# Altium project Lite Carrier for Mu.PrjPcb (part 2 of 2)

## Sheet USB2.0&USB3.0.SchDoc
size 594 x 420 mm
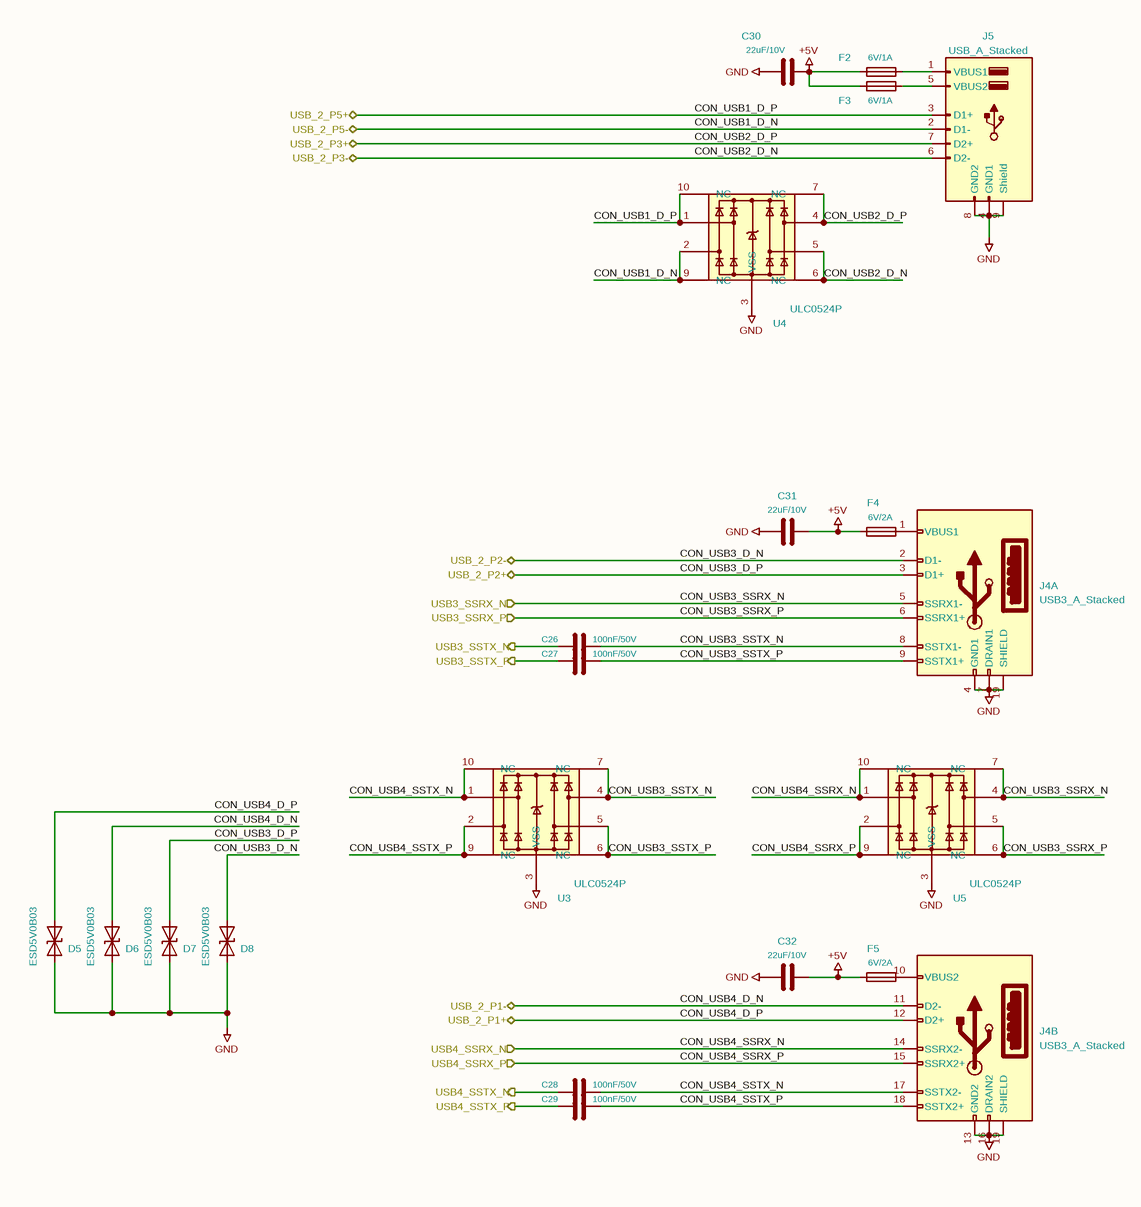
[diagram p17: USB2.0&USB3.0.SchDoc]

### Parts
C26  100nF/50V  [C_0402_1005Metric]
C27  100nF/50V  [C_0402_1005Metric]
C28  100nF/50V  [C_0402_1005Metric]
C29  100nF/50V  [C_0402_1005Metric]
C30  22uF/10V  [C_0603_1608Metric]
C31  22uF/10V  [C_0603_1608Metric]
C32  22uF/10V  [C_0603_1608Metric]
D5  ESD5V0B03  [D_0402_1005Metric]
D6  ESD5V0B03  [D_0402_1005Metric]
D7  ESD5V0B03  [D_0402_1005Metric]
D8  ESD5V0B03  [D_0402_1005Metric]
F2  6V/1A  [Fuse_0805_2012Metric]
F3  6V/1A  [Fuse_0805_2012Metric]
F4  6V/2A  [R_0805_2012Metric]
F5  6V/2A  [Fuse_0805_2012Metric]
J4  USB3_A_Stacked  [USB3_A_Molex_48406-0001_Horizontal_Stacked]  (parts A,B of 2)
J5  USB_A_Stacked  [USB_A_CUI_UJ2-ADH-TH_Horizontal_Stacked]
U3  ULC0524P  [Diodes_UDFN-10_1.0x2.5mm_P0.5mm]
U4  ULC0524P  [Diodes_UDFN-10_1.0x2.5mm_P0.5mm]
U5  ULC0524P  [Diodes_UDFN-10_1.0x2.5mm_P0.5mm]

### Ports
USB3_SSRX_N (in), USB3_SSRX_P (in), USB3_SSTX_N (out), USB3_SSTX_P (out), USB4_SSRX_N (in), USB4_SSRX_P (in), USB4_SSTX_N (out), USB4_SSTX_P (out), USB_2_P1+ (bidir), USB_2_P1- (bidir), USB_2_P2+ (bidir), USB_2_P2- (bidir), USB_2_P3+ (bidir), USB_2_P3- (bidir), USB_2_P5+ (bidir), USB_2_P5- (bidir)

### Nets
+5V: C30.2 C31.2 C32.2 F2.1 F3.1 F4.1 F5.1
GND: C30.1 C31.1 C32.1 D5.1(A1) D6.1(A1) D7.1(A1) D8.1(A1) J4.4(GND1) J4.7(DRAIN1) J4.13(GND2) J4.16(DRAIN2) J4.19(SHIELD) J5.4(GND1) J5.8(GND2) J5.9(Shield) U3.3(VSS) U4.3(VSS) U5.3(VSS)
CON_USB1_D_N: J5.2(D1-) U4.2 U4.9(NC) ; port USB_2_P5-
CON_USB1_D_P: J5.3(D1+) U4.1 U4.10(NC) ; port USB_2_P5+
CON_USB2_D_N: J5.6(D2-) U4.5 U4.6(NC) ; port USB_2_P3-
CON_USB2_D_P: J5.7(D2+) U4.4 U4.7(NC) ; port USB_2_P3+
CON_USB3_D_N: D8.2(A2) J4.2(D1-) ; port USB_2_P2-
CON_USB3_D_P: D7.2(A2) J4.3(D1+) ; port USB_2_P2+
CON_USB3_SSRX_N: J4.5(SSRX1-) U5.4 U5.7(NC) ; port USB3_SSRX_N
CON_USB3_SSRX_P: J4.6(SSRX1+) U5.5 U5.6(NC) ; port USB3_SSRX_P
CON_USB3_SSTX_N: C26.2 J4.8(SSTX1-) U3.4 U3.7(NC)
CON_USB3_SSTX_P: C27.2 J4.9(SSTX1+) U3.5 U3.6(NC)
CON_USB4_D_N: D6.2(A2) J4.11(D2-) ; port USB_2_P1-
CON_USB4_D_P: D5.2(A2) J4.12(D2+) ; port USB_2_P1+
CON_USB4_SSRX_N: J4.14(SSRX2-) U5.1 U5.10(NC) ; port USB4_SSRX_N
CON_USB4_SSRX_P: J4.15(SSRX2+) U5.2 U5.9(NC) ; port USB4_SSRX_P
CON_USB4_SSTX_N: C28.2 J4.17(SSTX2-) U3.1 U3.10(NC)
CON_USB4_SSTX_P: C29.2 J4.18(SSTX2+) U3.2 U3.9(NC)
USB3_SSTX_N: C26.1 ; port USB3_SSTX_N
USB3_SSTX_P: C27.1 ; port USB3_SSTX_P
USB4_SSTX_N: C28.1 ; port USB4_SSTX_N
USB4_SSTX_P: C29.1 ; port USB4_SSTX_P
NetF2_2: F2.2 J5.1(VBUS1)
NetF3_2: F3.2 J5.5(VBUS2)
NetF4_2: F4.2 J4.1(VBUS1)
NetF5_2: F5.2 J4.10(VBUS2)

Not connected (* = marked no-connect by the designer): U3 8(VSS); U4 8(VSS); U5 8(VSS)

### Notes on the sheet
- 1
- 2
- 3
- 4
- 5
- 6
- 7
- 8
- 9
- 10
- 11
- A
- B
- C
- D
- E
- F
- G
- H
- Title: Primer Carrier for LattePanda Mu
- File: USB2.0&USB3.0.kicad_sch
- Sheet: /
- DFRobot
- KiCad E.D.A.  kicad (5.1.4)-1
- Size: A2
- Date: 2024-03-13
- Rev: V1.0.0
- Id: 1/1

### Library data of the parts
C26-C29 = C: SCH_Show_Footprint: C0402; Value: 100nF/50V; Footprint: A_HDJ_Library:C_0402_1005Metric
C30-C32 = C: SCH_Show_Footprint: C603; Value: 22uF/10V; Footprint: A_HDJ_Library:C_0603_1608Metric
D5-D8 = ESD9B5.0ST5G: SCH_Show_Footprint: D0402; Value: ESD5V0B03; Footprint: A_HDJ_Library:D_0402_1005Metric
F2 F3 = Fuse: SCH_Show_Footprint: R0603; Value: 6V/1A; Footprint: A_HDJ_Library:Fuse_0805_2012Metric
F4 F5 = Fuse: SCH_Show_Footprint: R0805; Value: 6V/2A
  F4: Footprint: A_HDJ_Library:R_0805_2012Metric
  F5: Footprint: A_HDJ_Library:Fuse_0805_2012Metric
U3-U5 = D3V3XA4B10LP: Value: ULC0524P; Footprint: A_HDJ_Library:Diodes_UDFN-10_1.0x2.5mm_P0.5mm
J4 = USB3_A_Stacked: Value: USB3_A_Stacked; Footprint: A_HDJ_Library:USB3_A_Molex_48406-0001_Horizontal_Stacked
J5 = USB_A_Stacked: Value: USB_A_Stacked; Footprint: A_HDJ_Library:USB_A_CUI_UJ2-ADH-TH_Horizontal_Stacked

## Sheet fan&temp.SchDoc
size 594 x 420 mm
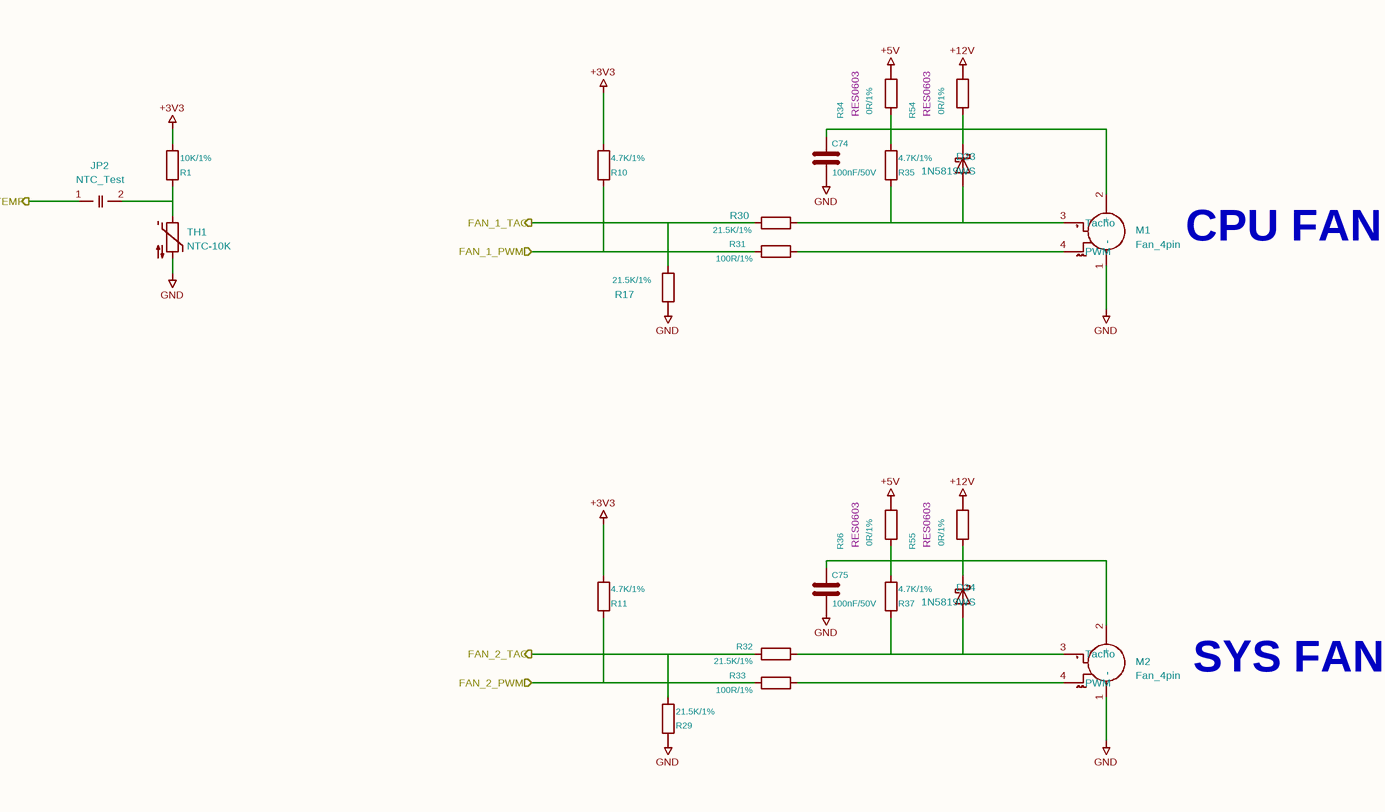
[diagram p18: fan&temp.SchDoc]

### Parts
(Parts that share a designator on the sheet are numbered #1, #2 ... from top to bottom, then left to right.)
C74#2  100nF/50V  [C_0402_1005Metric]
C75#2  100nF/50V  [C_0402_1005Metric]
D23#2  1N5819WS  [D_SOD-323]
D24#2  1N5819WS  [D_SOD-323]
JP2#2  NTC_Test  [SolderJumper-2_P1.3mm_Open_RoundedPad1.0x1.5mm]
M1#2  Fan_4pin  [JST_PH_B4B-PH-K_1x04_P2.00mm_Vertical]
M2#2  Fan_4pin  [JST_PH_B4B-PH-K_1x04_P2.00mm_Vertical]
R1#2  10K/1%  [R_0402_1005Metric]
R10#2  4.7K/1%  [R_0402_1005Metric]
R11#2  4.7K/1%  [R_0402_1005Metric]
R17#2  21.5K/1%  [R_0402_1005Metric]
R29#2  21.5K/1%  [R_0402_1005Metric]
R30#2  21.5K/1%  [R_0402_1005Metric]
R31  100R/1%  [R_0402_1005Metric]
R32#2  21.5K/1%  [R_0402_1005Metric]
R33#2  100R/1%  [R_0402_1005Metric]
R34#2  0R/1%  [RES0603]
R35#2  4.7K/1%  [R_0402_1005Metric]
R36#2  0R/1%  [RES0603]
R37#2  4.7K/1%  [R_0402_1005Metric]
R54#2  0R/1%  [RES0603]
R55#2  0R/1%  [RES0603]
TH1#2  NTC-10K  [R_0603_1608Metric]

### Ports
FAN_1_PWM (in), FAN_1_TAC (out), FAN_2_PWM (in), FAN_2_TAC (out), TEMP (out)

### Nets
+3V3: R1#2.1 R10#2.1 R11#2.1
+5V: R34#2.2 R36#2.2
+12V: R54#2.2 R55#2.2
GND: C74#2.2 C75#2.2 M1#2.1(-) M2#2.1(-) R17#2.2 R29#2.2 TH1#2.2
FAN_1_PWM: R10#2.2 R31.1 ; port FAN_1_PWM
FAN_1_TAC: R17#2.1 R30#2.2 ; port FAN_1_TAC
FAN_2_PWM: R11#2.2 R33#2.1 ; port FAN_2_PWM
FAN_2_TAC: R29#2.1 R32#2.1 ; port FAN_2_TAC
TEMP: JP2#2.1(A) ; port TEMP
NetC74#2_1: C74#2.1 D23#2.1(K) M1#2.2(+) R34#2.1 R35#2.1 R54#2.1
NetC75#2_1: C75#2.1 D24#2.1(K) M2#2.2(+) R36#2.1 R37#2.1 R55#2.1
NetD23#2_2: D23#2.2(A) M1#2.3(Tacho) R30#2.1 R35#2.2
NetD24#2_2: D24#2.2(A) M2#2.3(Tacho) R32#2.2 R37#2.2
NetJP2#2_2: JP2#2.2(B) R1#2.2 TH1#2.1
NetM1#2_4: M1#2.4(PWM) R31.2
NetM2#2_4: M2#2.4(PWM) R33#2.2

### Notes on the sheet
- CPU FAN
- SYS FAN
- 1
- 2
- 3
- 4
- 5
- 6
- 7
- 8
- 9
- 10
- 11
- A
- B
- C
- D
- E
- F
- G
- H
- Title:
- File: fan&temp.kicad_sch
- Sheet: /
- KiCad E.D.A.  kicad (5.1.4)-1
- Size: A2
- Date:
- Rev:
- Id: 1/1

### Library data of the parts
C74#2 C75#2 = C: DF_Comment: 贴片电容0402-100nF-50V-X7R_CC0402KRX7R9BB104; SCH_Show_Footprint: C0402; Value: 100nF/50V; Footprint: Capacitor_SMD:C_0402_1005Metric
D23#2 D24#2 = 1N5819WS: DF_Comment: 二极管-1N5819W-SOD323备选型号:B5819WS、JSPD140A; SCH_Show_Footprint: SOD-323; Value: 1N5819WS; Footprint: Diode_SMD:D_SOD-323
JP2#2 = SolderJumper_2_Open: Value: NTC_Test; Footprint: Jumper:SolderJumper-2_P1.3mm_Open_RoundedPad1.0x1.5mm
M1#2 M2#2 = Fan_4pin: DF_Comment: JST-B4B-PH-K(LF)(SN); Buy_Link: https://item.szlcsc.com/255571.html; Value: Fan_4pin; Footprint: Connector_JST:JST_PH_B4B-PH-K_1x04_P2.00mm_Vertical
R1#2 = R: DF_Comment: 贴片电阻0402-10K-1%; Value: 10K/1%; Footprint: Resistor_SMD:R_0402_1005Metric
R10#2 R11#2 R35#2 R37#2 = R: DF_Comment: 贴片电阻0402-4.7K-1%; Value: 4.7K/1%; Footprint: Resistor_SMD:R_0402_1005Metric
R17#2 R29#2 R30#2 R32#2 = R: DF_Comment: 贴片电阻0402-21.5K-1%; Value: 21.5K/1%; Footprint: Resistor_SMD:R_0402_1005Metric
R31 R33#2 = R: DF_Comment: 贴片电阻0402-100R-1%; Value: 100R/1%; Footprint: Resistor_SMD:R_0402_1005Metric
R34#2 R36#2 R54#2 R55#2 = R: DF_Comment: 贴片电阻0603-0R-5%(0603-1.6*0.8*0.4); Value: 0R/1%
TH1#2 = Thermistor_NTC: DF_Comment: 贴片热敏电阻0603-NCP18XH103F03RB-10K; Value: NTC-10K; Footprint: Resistor_SMD:R_0603_1608Metric

## Sheet RTC.SchDoc
size 297 x 209 mm

### Notes on the sheet
- 1
- 2
- 3
- 4
- 5
- 6
- A
- B
- C
- D
- Title:
- File: RTC.kicad_sch
- Sheet: /
- KiCad E.D.A.  kicad (5.1.4)-1
- Size: A4
- Date:
- Rev:
- Id: 1/1

## Nets that join several sheets
+3V3: PCIe x4 (6 pins), fan_temp (R63.1 R64.1 R65.1), HDMI (6 pins), PSU (13 pins), M.2 E&M Key (13 pins), Gigabit Ethernet (10 pins), GPIO (7 pins), fan&temp (R1#2.1 R10#2.1 R11#2.1)
+5V: fan_temp (5 pins), HDMI (D4.2), PSU (10 pins), USB2.0&USB3.0 (7 pins), fan&temp (R34#2.2 R36#2.2)
+12V: fan_temp (R75.2), PSU (13 pins), fan&temp (R54#2.2 R55#2.2)
+12VA: PCIe x4 (5 pins), PSU (10 pins)
GND: PCIe x4 (12 pins), fan_temp (7 pins), LattePanda Module (10 pins), HDMI (14 pins), PSU (47 pins), M.2 E&M Key (15 pins), Gigabit Ethernet (20 pins), GPIO (11 pins), USB2.0&USB3.0 (18 pins), fan&temp (7 pins)
VDC: LattePanda Module (A1.250), PSU (15 pins)
VPullup: LattePanda Module (R2.2), PSU (#FLG0906.1 D24#1.1 R53.2 TP13.1)
CON_USB1_D_N: LattePanda Module (A1.109), USB2.0&USB3.0 (J5.2 U4.2 U4.9)
CON_USB1_D_P: LattePanda Module (A1.111), USB2.0&USB3.0 (J5.3 U4.1 U4.10)
CON_USB2_D_N: LattePanda Module (A1.79), USB2.0&USB3.0 (J5.6 U4.5 U4.6)
CON_USB2_D_P: LattePanda Module (A1.81), USB2.0&USB3.0 (J5.7 U4.4 U4.7)
CON_USB3_D_N: LattePanda Module (A1.73), USB2.0&USB3.0 (D8.2 J4.2)
CON_USB3_D_P: LattePanda Module (A1.75), USB2.0&USB3.0 (D7.2 J4.3)
CON_USB4_D_N: LattePanda Module (A1.67), USB2.0&USB3.0 (D6.2 J4.11)
CON_USB4_D_P: LattePanda Module (A1.69), USB2.0&USB3.0 (D5.2 J4.12)
DDI_B_DDC_SCL: LattePanda Module (A1.171), HDMI (Q2.2 R5.2)
DDI_B_DDC_SDA: LattePanda Module (A1.169), HDMI (Q3.2 R3.2)
DDI_B_HPD: LattePanda Module (A1.183), HDMI (Q1.2 R4.2)
DDI_B_TX0+: LattePanda Module (A1.217), HDMI (C17.1)
DDI_B_TX0-: LattePanda Module (A1.215), HDMI (C18.1)
DDI_B_TX1+: LattePanda Module (A1.211), HDMI (C19.1)
DDI_B_TX1-: LattePanda Module (A1.209), HDMI (C20.1)
DDI_B_TX2+: LattePanda Module (A1.205), HDMI (C21.1)
DDI_B_TX2-: LattePanda Module (A1.203), HDMI (C22.1)
DDI_B_TX3+: LattePanda Module (A1.199), HDMI (C23.1)
DDI_B_TX3-: LattePanda Module (A1.197), HDMI (C24.1)
FAN_1_PWM: fan_temp (R64.2 R69.1 TP12.1), LattePanda Module (A1.2), fan&temp (R10#2.2 R31.1)
FAN_1_TAC: fan_temp (R66.1 R68.2 TP11.1), LattePanda Module (A1.4), fan&temp (R17#2.1 R30#2.2)
FAN_2_PWM: fan_temp (R65.2 R71.1), fan&temp (R11#2.2 R33#2.1)
FAN_2_TAC: fan_temp (R67.1 R70.1), fan&temp (R29#2.1 R32#2.1)
I2C2_SCL: LattePanda Module (A1.154), GPIO (J9.1 U11.1 U11.10)
I2C2_SDA: LattePanda Module (A1.156), GPIO (J7.1 U9.1 U9.10)
I2C3_SCL: LattePanda Module (A1.150), GPIO (J9.2 U11.2 U11.9)
I2C3_SDA: LattePanda Module (A1.152), GPIO (J7.2 U9.2 U9.9)
I2C4_SCL: LattePanda Module (A1.146), GPIO (J9.3 U11.4 U11.7)
I2C4_SDA: LattePanda Module (A1.148), GPIO (J7.3 U9.4 U9.7)
I2C5_SCL: LattePanda Module (A1.142), GPIO (J9.4 U11.5 U11.6)
I2C5_SDA: LattePanda Module (A1.144), GPIO (J7.4 U9.5 U9.6)
PCIE_RX_0+: PCIe x4 (J2.A16), M.2 E&M Key (J16.41)
PCIE_RX_0-: PCIe x4 (J2.A17), M.2 E&M Key (J16.43)
PCIE_RX_1+: PCIe x4 (J2.A21), M.2 E&M Key (J15.43)
PCIE_RX_1-: PCIe x4 (J2.A22), M.2 E&M Key (J15.41)
PCIE_TX_0+: PCIe x4 (C1.1), M.2 E&M Key (C55.1)
PCIE_TX_0-: PCIe x4 (C2.1), M.2 E&M Key (C56.1)
PCIE_TX_1+: PCIe x4 (C3.1), M.2 E&M Key (C49.1)
PCIE_TX_1-: PCIe x4 (C4.1), M.2 E&M Key (C50.1)
SLS_S3: LattePanda Module (A1.7), PSU (JP1.3)
SOC_UART0_RX: LattePanda Module (A1.137), GPIO (J8.1 U10.1 U10.10)
SOC_UART0_TX: LattePanda Module (A1.139), GPIO (J10.1 U12.1 U12.10)
SOC_UART1_RX: LattePanda Module (A1.141), GPIO (J8.2 U10.2 U10.9)
SOC_UART1_TX: LattePanda Module (A1.143), GPIO (J10.2 U12.2 U12.9)
SOC_UART2_RX: LattePanda Module (A1.140), GPIO (J8.3 U10.4 U10.7)
SOC_UART2_TX: LattePanda Module (A1.138), GPIO (J10.3 U12.4 U12.7)
TEMP: fan_temp (JP2#1.1), fan&temp (JP2#2.1)
USB_2_P7+: LattePanda Module (A1.76), M.2 E&M Key (J16.3)
USB_2_P7-: LattePanda Module (A1.78), M.2 E&M Key (J16.5)
~{{PLT_RST}}: PCIe x4 (J2.A11 TP1.1), LattePanda Module (A1.105), M.2 E&M Key (J15.50 J16.52), Gigabit Ethernet (U6.19)
~{{PWR_LED}{slash}}{PSON}: LattePanda Module (A1.5), HDMI (R19.1), PSU (JP1.1 R47.1)
~{{PWR_SW}}: LattePanda Module (A1.1), PSU (R48.2)
~{{RST_SW}}: LattePanda Module (A1.3), PSU (R55#1.2)
~{{WAKE}}: PCIe x4 (J2.B11), M.2 E&M Key (J15.54 J16.55)